# Altium schematic sheet motor_control_an.SchDoc: Fault-Tolerant Quadcopter
size A; DrawnBy: Vaughn Kottler; Engineer: Vaughn Kottler; Revision: A
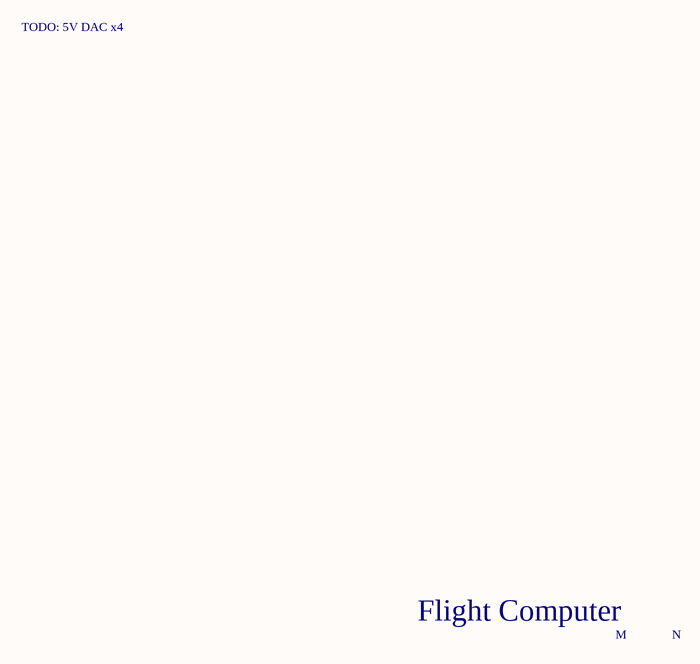
[diagram p0: motor_control_an.SchDoc]

## Notes on the sheet
- TODO: 5V DAC x4
- Flight Computer
- M
- N